# EAGLE design Spark Stick v1.0 (EAGLE 9.4.2)
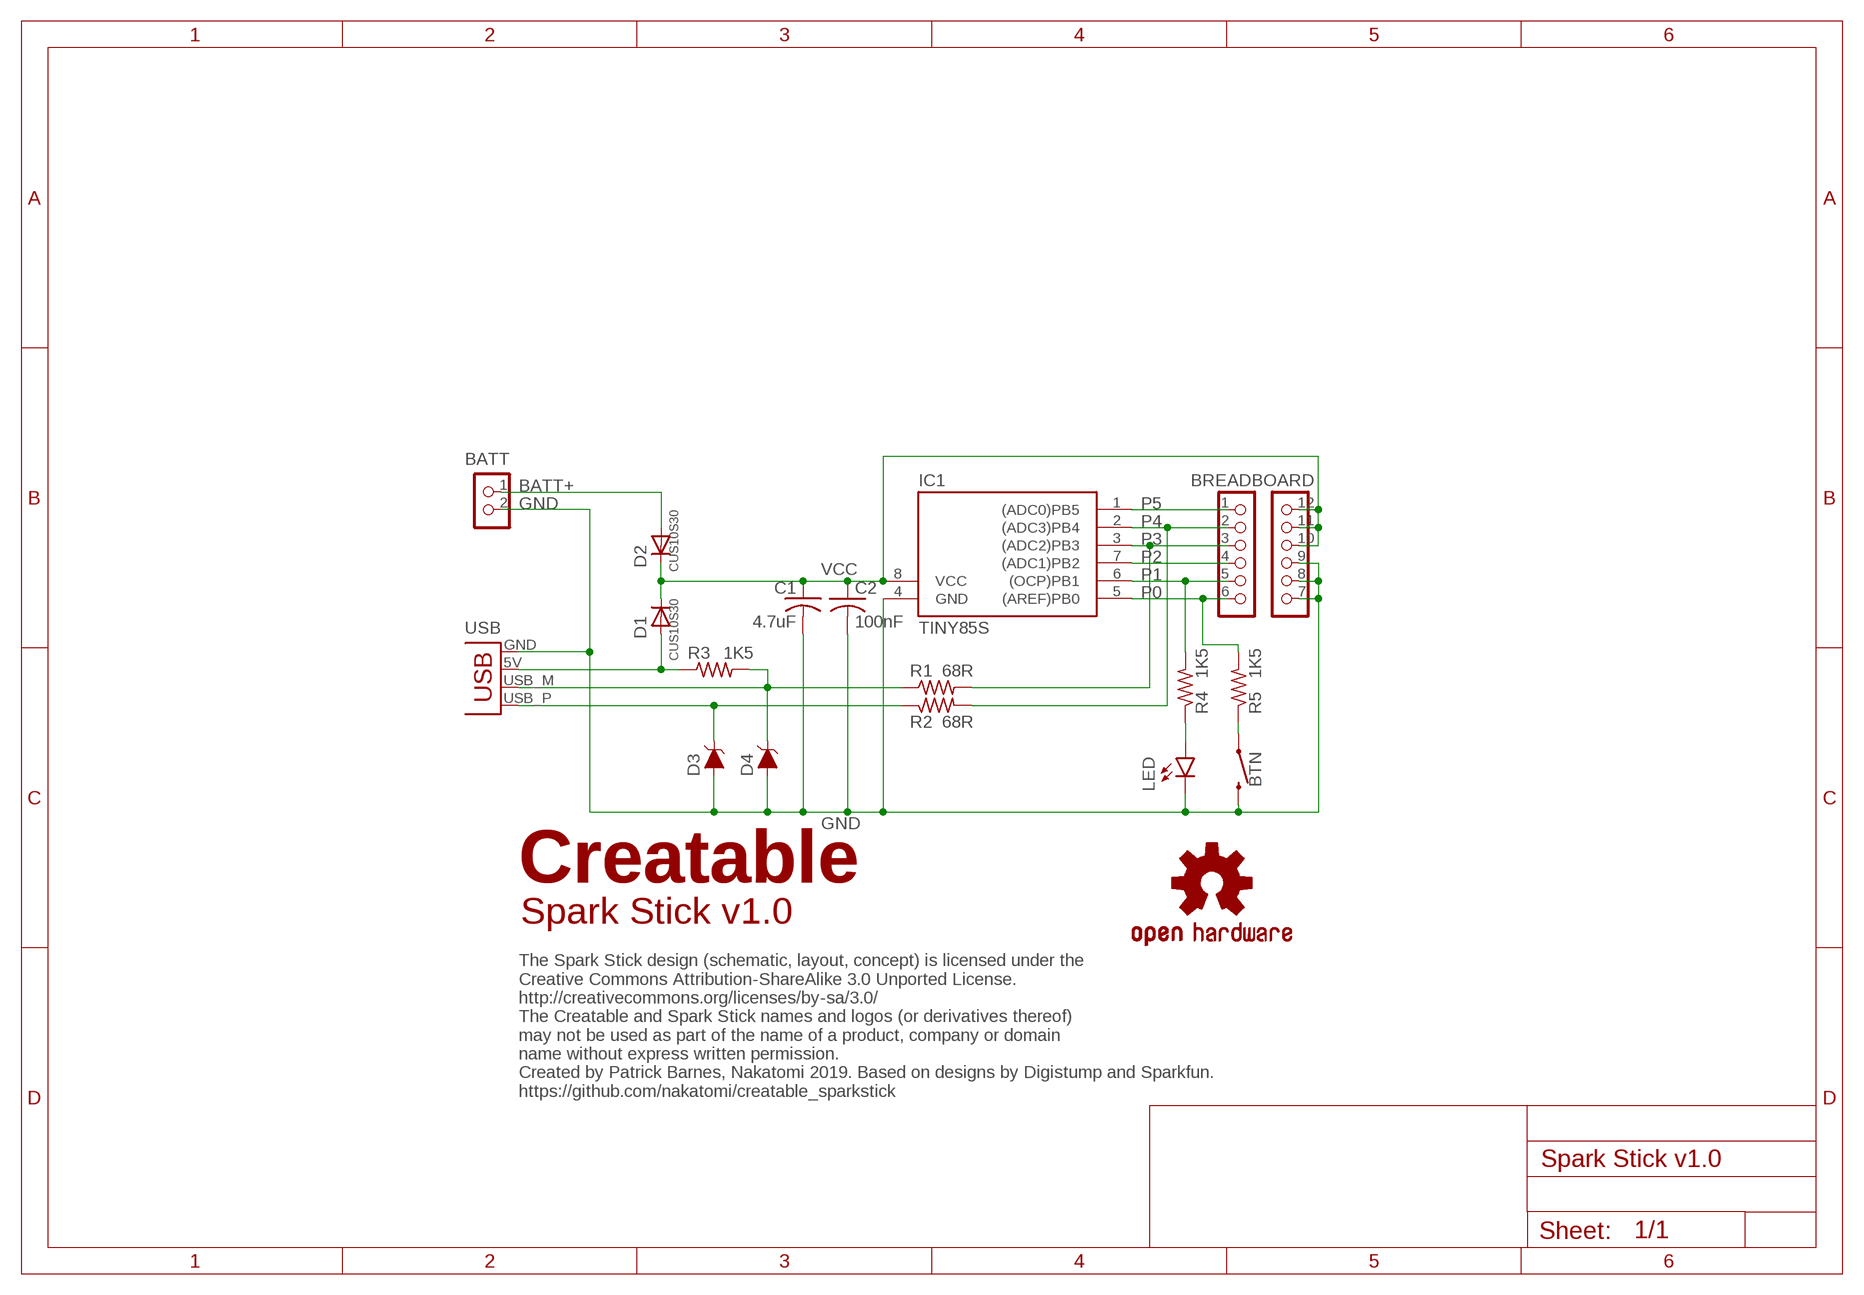
[diagram p0: schematic, sheet 1]

## Parts
BATT  CON_HEADER_1X02ROUND  [CON_HEADER_M1X2_ROUND]
BREADBOARD  CON_HEADER_2X06  [CON_HEADER_M2X6_BREADBOARD]
BTN  MOMENTARY-SWITCH-SPST-PTS810  [PTS810SJG250SMTRLFS]
C1  4.7uF  CAPACITORC0805K  [C0805K]
C2  100nF  CAPACITORC0805K  [C0805K]
D1  CUS10S30  DIODESOD-323F  [SOD-323F]
D2  CUS10S30  DIODESOD-323F  [SOD-323F]
D3  DIODE-ZENER-SOD-323F  [SOD-323F]
D4  DIODE-ZENER-SOD-323F  [SOD-323F]
IC1  TINY85S  [SOIC8]
LED  RED LED  LED0603  [LED-0603]
LOGO1  OSHW-LOGOM  [OSHW-LOGO-M]
LOGO_2A  LOGO_CREATABLECREAT  [LOGO_CREATABLE_CREAT]
LOGO_2B  LOGO_CREATABLEABLE  [LOGO_CREATABLE_ABLE]
R1  68R  RESISTORR0603  [R0603]
R2  68R  RESISTORR0603  [R0603]
R3  1K5  RESISTORR0603  [R0603]
R4  1K5  RESISTORR0603  [R0603]
R5  1K5  RESISTORR0603  [R0603]
USB  MICRO USB  SPARKFUN-CONNECTORS_USBPCB  [SPARKFUN-CONNECTORS_USB-A-PCB]

## Nets
BATT+ [power]: BATT.1 D2.A
BTN: BTN.1 BTN.2 R5.1
D+: D3.C R2.1 USB.USB_P(D+)
D-: D4.C R1.1 R3.2 USB.USB_M(D-)
GND [power]: BATT.2 BREADBOARD.7 BREADBOARD.8 BREADBOARD.9 BTN.3 BTN.4 C1.2 C2.2 D3.A D4.A IC1.4(GND) LED.C USB.GND
LED: LED.A R4.1
P0: BREADBOARD.6 IC1.5((AREF)PB0) R5.2
P1: BREADBOARD.5 IC1.6((OCP)PB1) R4.2
P2: BREADBOARD.4 IC1.7((ADC1)PB2)
P3: BREADBOARD.3 IC1.3((ADC2)PB3) R1.2
P4: BREADBOARD.2 IC1.2((ADC3)PB4) R2.2
P5: BREADBOARD.1 IC1.1((ADC0)PB5)
VBUS: D1.A R3.1 USB.5V(VBUS)
VCC [power]: BREADBOARD.10 BREADBOARD.11 BREADBOARD.12 C1.1 C2.1 D1.C D2.C IC1.8(VCC)

## Notes on the sheet
- Spark Stick v1.0
- The Spark Stick design (schematic, layout, concept) is licensed under the 
  Creative Commons Attribution-ShareAlike 3.0 Unported License. 
  http://creativecommons.org/licenses/by-sa/3.0/
  The Creatable and Spark Stick names and logos (or derivatives thereof) 
  may not be used as part of the name of a product, company or domain 
  name without express written permission.
  Created by Patrick Barnes, Nakatomi 2019. Based on designs by Digistump and Sparkfun.
  https://github.com/nakatomi/creatable_sparkstick

## Library data of the parts
BATT = Nakatomi:CON_HEADER_1X02; POPULATE: NO
BREADBOARD = Nakatomi:CON_HEADER_2X06; POPULATE: NO
BTN = Nakatomi:MOMENTARY-SWITCH-SPST: Momentary Switch (Pushbutton) - SPST Normally-open (NO) SPST momentary switches (buttons, pushbuttons). Variants PTH-12MM - 12mm square, through-hole Momentary Pushbutton Switch - 12mm Square <https://www.sparkfun.com/products/9190> (COM-09190) PTH-6.0MM, PTH-6.0MM-KIT - 6.0mm square, through-hole Mini Pushbutton Switch <https://www.sparkfun.com/products/97> (COM-00097) KIT package intended for soldering kit's - only one side of pads' copper is exposed. PTH-RIGHT-ANGLE-KIT - Right-angle, through-hole Right Angle Tactile Button <https://www.sparkfun.com/products/10791> - Used on SparkFun BigTime Watch Kit <https://www.sparkfun.com/products/11734> SMD-12MM - 12mm square, surface-mount Tactile Button - SMD (12mm) <https://www.sparkfun.com/products/12993> (COM-12993) Used on SparkFun PicoBoard <https://www.sparkfun.com/products/11888> SMD-4.5MM - 4.5mm Square Trackball Switch Used on SparkFun Blackberry Trackballer Breakout <https://www.sparkfun.com/products/13169> SMD-4.6MMX2.8MM - 4.60mm x 2.80mm, surface mount Used on SparkFun SAMD21 Mini Breakout <https://www.sparkfun.com/products/13664> SMD-5.2MM, SMD-5.2-REDUNDANT - 5.2mm square, surface-mount Mini Pushbutton Switch - SMD <https://www.sparkfun.com/products/8720> (COM-08720) Used on Arduino Pro Mini <https://www.sparkfun.com/products/11114> REDUNDANT package connects both switch circuits together SMD-6.0X3.5MM - 6.0 x 3.5mm, surface mount Momentary Reset Switch SMD <https://www.sparkfun.com/products/8229> (COM-08229) SMD-6.2MM-TALL - 6.2mm square, surface mount Tactile Button - SMD (6mm) <https://www.sparkfun.com/products/12992> Used on SparkFun Digital Sandbox <https://www.sparkfun.com/products/12651> SMD-RIGHT-ANGLE - Right-angle, surface mount Used on SparkFun Block for Intel® Edison - Arduino <https://www.sparkfun.com/products/13036>; LCSC_ID: C221897; URL: https://lcsc.com/product-detail/Tactile-Switches_C-K_PTS810SJS250SMTRLFS_C-K-PTS810SJS250SMTRLFS_C221897.html
C1 = Nakatomi:CAPACITOR: CAPACITOR, American symbol; LCSC_ID: C107365; URL: https://lcsc.com/product-detail/Multilayer-Ceramic-Capacitors-MLCC-SMD-SMT_SAMSUNG_CL21B475KOFNNNE_4-7uF-475-10-16V_C107365.html
C2 = Nakatomi:CAPACITOR: CAPACITOR, American symbol; LCSC_ID: C1760; URL: https://lcsc.com/product-detail/Multilayer-Ceramic-Capacitors-MLCC-SMD-SMT_SAMSUNG_CL21F104ZBCNNNC_100nF-104-80-20-50V_C1760.html
D1 D2 = Nakatomi:DIODE: Diode SMADIODE - SMA Surface Mount Package 20V 1A Schottky Diode Digikey: 641-1014-6-ND DO-1N4148 - Through Hole Small Current Diode SOD-123 20V 1 A (.5mV Vf) Schottky Diode - Digikey: MBRX120TPMSCT-ND SOD-323 10V 570mA (.38mV Vf, 3ns) Schottky Diode - Digikey: ZLLS410CT-ND SOD-523 30V 30mA Schottky Diode (RB751S-40TE61) - Digikey: RB751S-40TE61CT-ND SOT23-R/W - SOT23 Package (R = Solder Paste/Reflow Ovens, W = Hand-Soldering) BAT54Film 40V 300mA - Digikey: 497-7162-1-ND; LCSC_ID: C146335; URL: https://lcsc.com/product-detail/Schottky-Barrier-Diodes-SBD_TOSHIBA-CUS10S30-H3F_C146335.html
D3 D4 = Nakatomi:DIODE-ZENER: Zener Diode A Zener diode allows current to flow from its anode to its cathode like a normal semiconductor diode, but it also permits current to flow in the reverse direction when its "Zener voltage" is reached. - WIkipedia; LCSC_ID: C353525; URL: https://lcsc.com/product-detail/Zener-Diodes_Shandong-Jingdao-Microelectronics-BZT52C3V6S_C353525.html
IC1 = Nakatomi:TINY85: MICROCONTROLLER 2.7 V 1 Kbytes FLASH 64 bytes EEPROM 4-channel 10 bit ADC; LCSC_ID: C89852; MPN: ATTINY85-20SU; OC_FARNELL: unknown; OC_NEWARK: unknown; URL: https://lcsc.com/product-detail/FLASH_ATMEL_ATTINY85-20SU_ATTINY85-20SU_C89852.html
LED = Nakatomi:LED: LED (Generic) Standard schematic elements and footprints for 5mm, 3mm, 1206, and 0603 sized LEDs. Generic LEDs with no color specified.; COLOR: GREEN; LCSC_ID: C125094; URL: https://lcsc.com/product-detail/Light-Emitting-Diodes-LED_SMD-green_C125094.html
LOGO1 = SparkFun-Aesthetics:OSHW-LOGO: Open-Source Hardware (OSHW) Logo This logo indicates the piece of hardware it is found on incorporates a OSHW license and/or adheres to the definition of open source hardware found here: http://freedomdefined.org/OSHW; POPULATE: NO
LOGO_2A LOGO_2B = Nakatomi:LOGO_CREATABLE; POPULATE: NO
R1 R2 = Nakatomi:RESISTOR: RESISTOR, American symbol; LCSC_ID: C192544; URL: https://lcsc.com/product-detail/Others_KOA-Speer-Elec-RK73B1JTTD680J_C192544.html
R3-R5 = Nakatomi:RESISTOR: RESISTOR, American symbol; LCSC_ID: C118361; URL: https://lcsc.com/product-detail/Chip-Resistor-Surface-Mount_FH-Guangdong-Fenghua-Advanced-Tech-RS-03K152JT_C118361.html
USB = Nakatomi:SPARKFUN-CONNECTORS_USB: USB Connectors USB-B-PTH is fully proven SKU : PRT-00139/CONN-08278 USB-miniB is fully proven SKU : PRT-00587 USB-A-PCB is untested. USB-A-H is throughly reviewed, but untested. Spark Fun Electronics SKU : PRT-00437 USB-B-SMT is throughly reviewed, but untested. Needs silkscreen touching up. USB-A-S has not been used/tested USB-MB-H has not been used/tested USB-MICROB has been used. CONN-09505; POPULATE: NO

## Net classes
1 signal: width 0.305 mm
2 power: width 0.305 mm

## Board
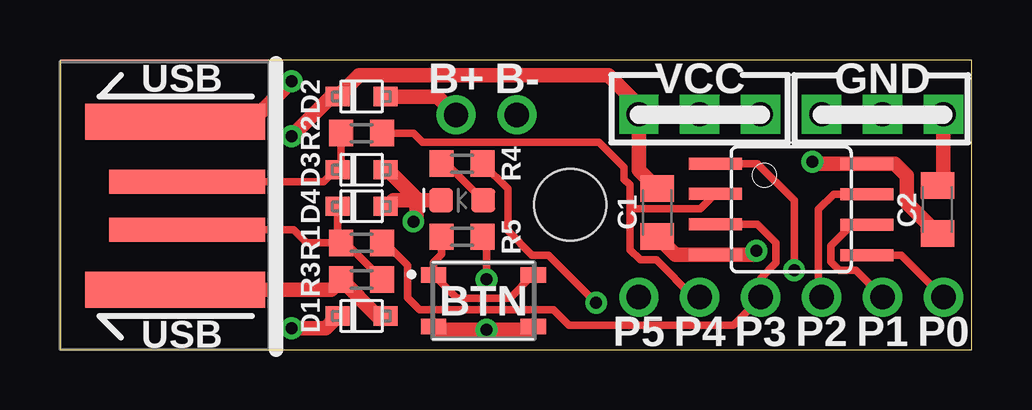
[diagram p1: board, top side]
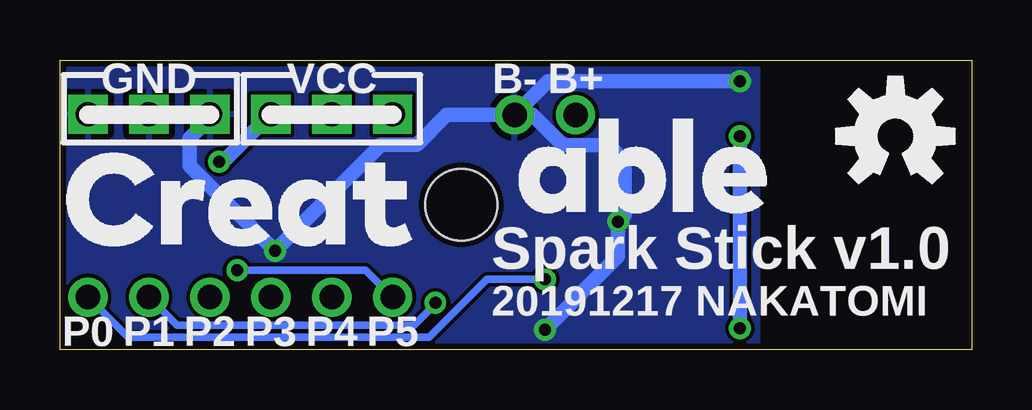
[diagram p2: board, bottom side, seen from below]

Size 38 x 12.06 mm. Coordinates in mm from the lower left corner, seen from the top.
Outline: 0,0 38,0 38,12.06 0,12.06 0,0
Copper layers (1*16): Top 0.035mm / dielectric 2mm / Bottom 0.035mm
Design rules "default *": minimum track width 6mil, minimum drill 0.5mm, track to track 6mil, track to pad 6mil, pad to pad 6mil, via to via 6mil, smd to smd 6mil, copper to edge 10mil, drill to drill 6mil, minimum pad ring 10mil, minimum via ring 8mil, stop-mask expansion 4mil, vias tented up to drill 20mil, thermal gap 10mil
Holes 3 mm at 21.27,6.03
tKeepout: area 18.8,3.5 to 23.8,8.5

### Footprints (pad centres in the part's own frame; a part is rotated, then mirrored left to right if it is on the bottom)
CON_HEADER_M1X2_ROUND = drill 1.02 pad 1.632: 1 0,0; 2 2.54,0
CON_HEADER_M2X6_BREADBOARD = drill 1.02 pad 1.632: 1 0,-3.81; 2 2.54,-3.81; 3 5.08,-3.81; 4 7.62,-3.81; 5 10.16,-3.81; 6 12.7,-3.81 | drill 1.02 pad 1.632 square: 7 12.7,3.81; 8 10.16,3.81; 9 7.62,3.81; 10 5.08,3.81; 11 2.54,3.81; 12 0,3.81
PTS810SJG250SMTRLFS = smd 1.05 x 0.65: 1 -2.075,1.075; 2 2.075,1.075; 3 -2.075,-1.075; 4 2.075,-1.075
C0805K = smd 1.1 x 1.4: 1 -1,0; 2 1,0
SOD-323F = smd 1 x 0.8: A -1,0; C 1,0
SOIC8 = smd 0.5 x 2.2: 1 -1.905,-3.154; 2 -0.645,-3.154; 3 0.625,-3.154; 4 1.895,-3.154; 5 1.905,3.154; 6 0.635,3.154; 7 -0.635,3.154; 8 -1.905,3.154
LED-0603 = smd 1 x 1: A -0.877,0; C 0.877,0
R0603 = smd 1 x 1.1: 1 -0.85,0; 2 0.85,0
SPARKFUN-CONNECTORS_USB-A-PCB = smd 7.5 x 1.5: 5V -0.2,-3.5; GND -0.2,3.5 | smd 6.5 x 1: USB_M 0.3,-1; USB_P 0.3,1

### Placement (x,y rotation side)
BATT  16.51,9.78 0 top
BREADBOARD  24.13,5.99 0 top
BTN  17.65,2.03 0 top
C1  24.89,5.71 270 top
C2  36.58,5.84 90 top
D1  12.57,1.4 180 top
D2  12.57,10.54 180 top
D3  12.57,7.49 180 top
D4  12.57,5.97 180 top
IC1  30.48,5.84 270 top
LED  16.76,6.22 180 top
LOGO1  3.17,8.89 0 bottom
LOGO_2A  37.72,4.32 0 bottom
LOGO_2B  18.8,5.71 0 bottom
R1  12.57,4.45 0 top
R2  12.57,9.02 0 top
R3  12.57,2.92 0 top
R4  16.76,7.75 0 top
R5  16.76,4.7 0 top
USB  5,5.99 0 top

### Tracks (layer width: path | path; a pad name or v marks a point on that pad's centre or on a via)
BATT+
  Top 0.61: BATT.1 15.75,10.54 D2.A
BTN
  Top 0.305: BTN.2 18.76,2.14 16.54,2.14 BTN.1 15.58,3.64 15.91,3.98 R5.1
D+
  Top 0.305: USB.USB_P 11,6.99 11.54,7.53 11.72,7.79 R2.1
D-
  Top 0.305: R1.1 11.9,4.45 R3.2 | USB.USB_M 9.74,4.99 10.29,4.45 R1.1 | D4.C 11.57,4.59 R1.1
GND  (via drill 0.5)
  Top 0.61: BREADBOARD.9 BREADBOARD.8 BREADBOARD.7 36.83,7.1 C2.2 | USB.GND 7.97,9.49 v9.65,11.18 | BTN.4 19.6,0.83 v17.78,0.83 15.71,0.83 BTN.3 | C1.2 25.66,3.95 IC1.4 28.87,3.95 v29.04,4.12 | 13.61,7.53 14.92,6.22 | 14.87,6.22 14.92,6.22 | 14.92,6.22 LED.C | 13.61,5.93 13.9,6.22 14.87,6.22 | 14.87,6.22 14.87,5.47 v14.73,5.33
  Bottom 0.61: v9.65,11.18 17.65,11.18 BATT.2 | BREADBOARD.9 31.75,9.64 32.59,8.8 32.59,7.67 v29.04,4.12 24.62,8.53 23.12,8.53 21.88,9.78 BATT.2 | BATT.2 18.31,9.78 17.04,8.51 15.11,8.51 14.48,7.87 14.48,5.59 v14.73,5.33 14.73,3.88 v17.78,0.83
  pour Bottom: 8.89,0 38.1,0 38.1,12.7 8.89,12.7
LED
  Top 0.305: LED.A 16.12,7.75 R4.1
P0  (via drill 0.5)
  Top 0.305: BREADBOARD.6 35.08,3.94 IC1.5 | R5.2 17.78,4.53 v17.78,2.92
  Bottom 0.305: BREADBOARD.6 35.15,0.51 22.61,0.51 20.19,2.92 v17.78,2.92
P1  (via drill 0.5)
  Top 0.305: BREADBOARD.5 33.17,3.3 32.49,3.3 32.13,3.66 32.13,4.32 33.02,5.21 IC1.6 | R4.2 18.67,6.69 18.67,4.95 19.68,3.94 20.37,3.94 v22.35,1.95
  Bottom 0.305: BREADBOARD.5 33.12,1.02 23.24,1.02 22.35,1.91 v22.35,1.95
P2
  Top 0.305: BREADBOARD.4 31.62,2.31 31.62,5.84 32.26,6.48 IC1.7
P3
  Top 0.305: R1.2 13.55,4.45 14.48,3.51 14.48,2.16 14.99,1.65 20.57,1.65 21.21,1.02 28.07,1.02 29.21,2.16 | 29.21,2.16 BREADBOARD.3 | IC1.3 29.07,5.22 29.84,4.45 29.84,3.61 29.21,2.98 29.21,2.16
P4
  Top 0.305: R2.2 14.73,9.02 15.11,8.64 22.48,8.64 23.52,7.59 23.52,7.1 23.76,6.86 23.76,6.04 | 23.76,6.04 23.94,5.86 26.7,5.86 IC1.2 | BREADBOARD.2 26.42,2.18 24.87,3.73 24.19,3.73 23.76,4.17 23.76,6.04
P5  (via drill 0.5)
  Top 0.305: v30.61,3.3 30.61,6.22 29.08,7.75 IC1.1
  Bottom 0.305: v30.61,3.3 29.68,3.3 29.67,3.31 25.25,3.31 BREADBOARD.1
VBUS
  Top 0.61: USB.5V 11.3,2.49 R3.1 13.25,1.4 D1.A
VCC  (via drill 0.5)
  Top 0.61: BREADBOARD.10 BREADBOARD.11 BREADBOARD.12 | C2.1 35.31,6.11 35.31,7.24 34.8,7.75 IC1.8 31.45,7.75 v31.37,7.82 | v9.65,8.89 11.3,10.54 D2.C 12.46,11.43 22.86,11.43 24.13,10.16 BREADBOARD.12 | C1.1 24.13,7.48 BREADBOARD.12 | D1.C 11.06,0.89 v9.65,0.89
  Bottom 0.61: v31.37,7.82 31.19,7.82 BREADBOARD.10 | v9.65,8.89 v9.65,0.89

### Text on the board
tPlace: USB | B+ | B- | VCC | GND | USB | P5 | P4 | P3 | P2 | P1 | P0
bPlace: B+ | B- | VCC | GND | Spark Stick v1.0 | 20191217 NAKATOMI | P5 | P4 | P3 | P2 | P1 | P0
Reference: The Spark Stick design (schematic, layout, concept) is licensed / under the Creative Commons Attribution-ShareAlike 3.0 Unported License. / http://creativecommons.org/licenses/by-sa/3.0/ / The Creatable and Spark Stick names and logos (or derivatives / thereof) may not be used as part of the name of a product, / company or domain name without express written permission. / Created by Patrick Barnes, Nakatomi 2019. / Based on designs by Digistump and Sparkfun. / https://github.com/nakatomi/creatable_sparkstick